# Altium schematic sheet UI_Ticketing_Master.SchDoc
size A4; Author: Mario Dos Santos; Organization: ETML-ES; Address1: Avenue Recordon 1; Address2: 1004 Lausanne; Address3: Switzerland; Revision: C; SheetNumber: 5; SheetTotal: 6
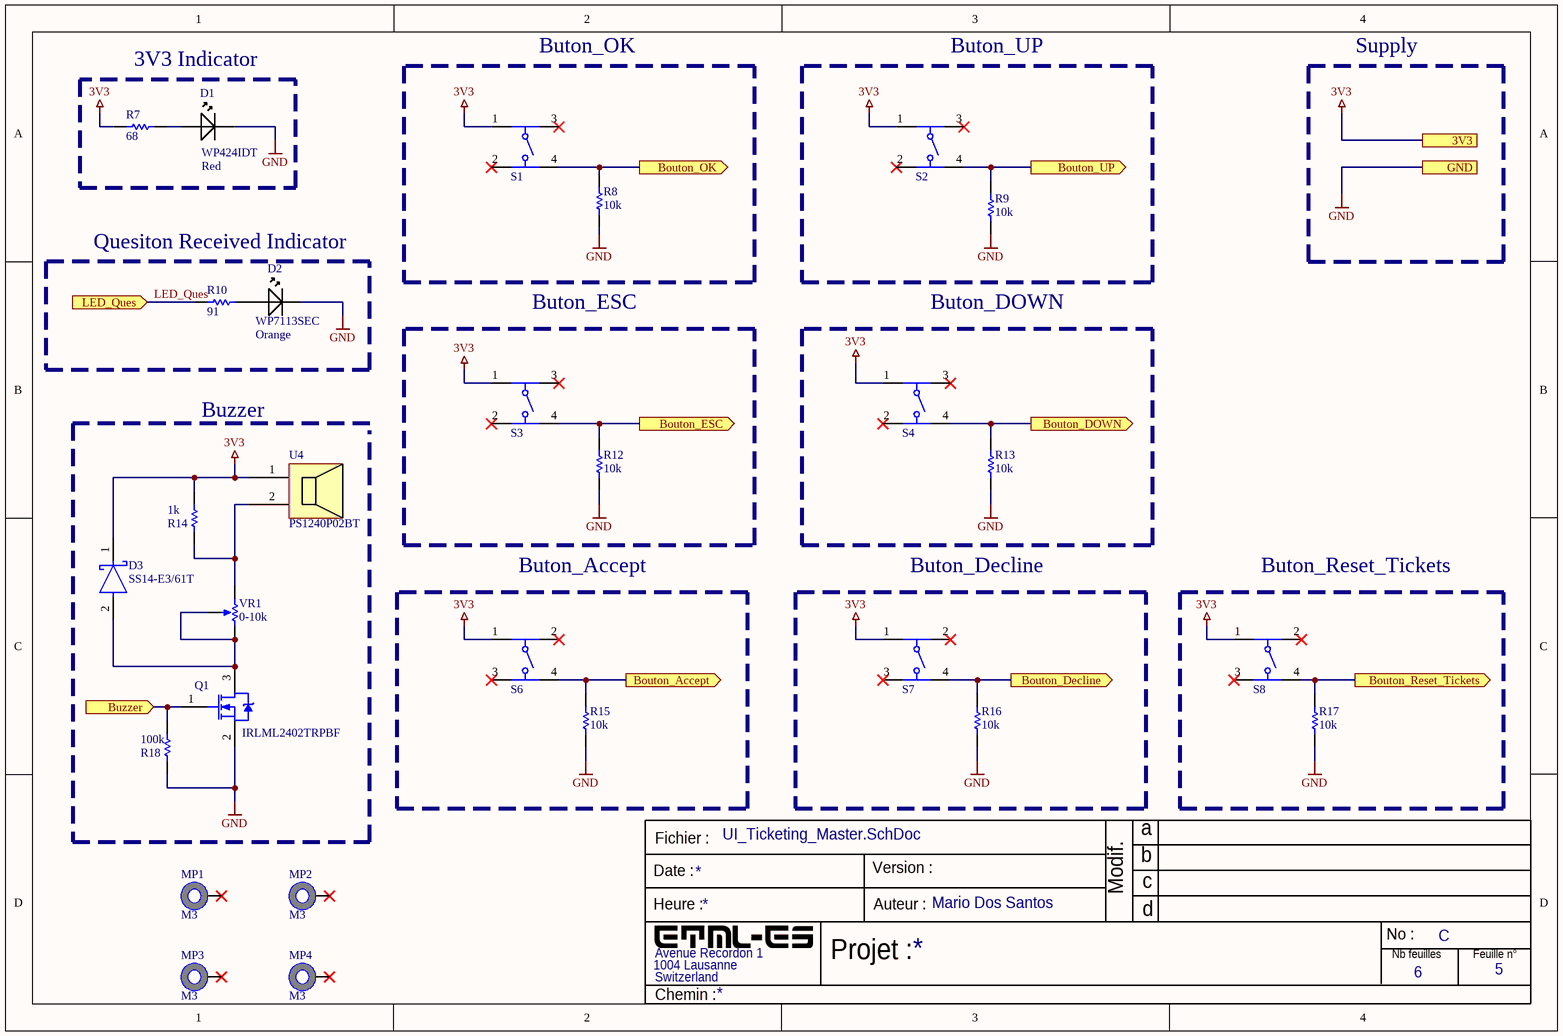
[diagram p0: UI_Ticketing_Master.SchDoc]

## Parts
D1  WP424IDT  Color: Red  [LED-2P-2.28-3MM]
D2  WP7113SEC  Color: Orange  [Type 5mm]
D3  SS14-E3/61T  [FP-95400-MFG]
MP1  M3  [9774010151]
MP2  M3  [9774010151]
MP3  M3  [9774010151]
MP4  M3  [9774010151]
Q1  IRLML2402TRPBF  [INTR-IRLML2402TRPBF-3_V]
R7  68  [RESC0805(2012)_L]
R8  10k  [RESC0805(2012)_L]
R9  10k  [RESC0805(2012)_L]
R10  91  [RESC0805(2012)_L]
R12  10k  [RESC0805(2012)_L]
R13  10k  [RESC0805(2012)_L]
R14  1k  [RESC2013X60X35ML10T20]
R15  10k  [RESC0805(2012)_L]
R16  10k  [RESC0805(2012)_L]
R17  10k  [RESC0805(2012)_L]
R18  100k  [RESC2013X60X35ML10T20]
S1  430152095826  [430152095826]  (value not drawn)
S2  430152095826  [430152095826]  (value not drawn)
S3  430152095826  [430152095826]  (value not drawn)
S4  430152095826  [430152095826]  (value not drawn)
S6  430466073726  [4304x60737x6_12x12x7.3]  (value not drawn)
S7  430466073726  [4304x60737x6_12x12x7.3]  (value not drawn)
S8  430466073726  [4304x60737x6_12x12x7.3]  (value not drawn)
U4  PS1240P02BT  [Buzzer]
VR1  0-10k  [BOUR-3362P]

## Blocks framed on the sheet
3V3 Indicator: D1 R7
Buton_OK: R8 S1
Buton_UP: R9 S2
Quesiton Received Indicator: D2 R10
Buton_ESC: R12 S3
Buton_DOWN: R13 S4
Buton_Accept: R15 S6
Buton_Decline: R16 S7
Buton_Reset_Tickets: R17 S8

## Ports
3V3, Bouton_Accept (out), Bouton_Decline (out), Bouton_DOWN (out), Bouton_ESC (out), Bouton_OK (out), Bouton_Reset_Tickets (out), Bouton_UP (out), Buzzer (in), GND, LED_Ques (in)

## Nets
3V3: D3.1(C) R7.2 R14.2 S1.1 S2.1 S3.1 S4.1 S6.1 S7.1 S8.1 U4.1 ; port 3V3
GND: D1.2(Cathode) D2.1(Cathode) Q1.2(S) R8.2 R9.2 R12.2 R13.2 R15.2 R16.2 R17.2 R18.1 ; port GND
Bouton_Accept: R15.1 S6.4 ; port Bouton_Accept
Bouton_Decline: R16.1 S7.4 ; port Bouton_Decline
Bouton_DOWN: R13.1 S4.4 ; port Bouton_DOWN
Bouton_ESC: R12.1 S3.4 ; port Bouton_ESC
Bouton_OK: R8.1 S1.4 ; port Bouton_OK
Bouton_Reset_Tickets: R17.1 S8.4 ; port Bouton_Reset_Tickets
Bouton_UP: R9.1 S2.4 ; port Bouton_UP
Buzzer: Q1.1(G) R18.2 ; port Buzzer
LED_Ques: R10.2 ; port LED_Ques
NetD1_1: D1.1(Anode) R7.1
NetD2_2: D2.2(Anode) R10.1
NetD3_2: D3.2(A) Q1.3(D) VR1.2(S) VR1.3(CW)
NetR14_1: R14.1 U4.2 VR1.1(CCW)

Not connected (* = marked no-connect by the designer): MP1 1*; MP2 1*; MP3 1*; MP4 1*; S1 2* 3*; S2 2* 3*; S3 2* 3*; S4 2* 3*; S6 2* 3*; S7 2* 3*; S8 2* 3*

## Notes on the sheet
- Supply
- Buzzer
- Fichier :
- a
- Date :
- Heure :
- Version :
- Auteur :
- Modif.
- b
- c
- d
- Projet :
- No :
- Nb feuilles
- Feuille n°
- Chemin :

## Library data of the parts
D1 D2 = LED: Supplier: Digi-Key; Supplier unit price: 0.4
  D1: Supplier Part Number: 754-1305-ND; Value: WP424IDT
  D2: Supplier A: *; Supplier B: *; Supplier A Ref: 754-1271-ND; Supplier B Ref: *; Manufacturer URL: *; Manufacturer Ref: *; Package: *; Value: WP7113SEC; Supplier Part Number: 754-1271-ND
D3 = CMP-02539-000035-1: DIODE SCHOTTKY 40V 1A DO214AC; Manufacturer: Vishay; Peak Reverse Current: 0.2mA; Standoff Height: 0mm; Max Junction Temp: +150°C; Max Surge Forward Current: 40A; RoHS: TRUE; Digikey Description: DIODE SCHOTTKY 40V 1A DO214AC; Category: Diode; Device Class L3: Schottky Diodes; Temperature Range High: +150°C; Automotive: No; Temperature: -65°C to +150°C; Device Class L2: Diodes; Forward Current: 1A; Temperature Range Low: -65°C; Footprint Url: http://www.vishay.com/docs/95400/sma.pdf; Octopart: https://octopart.com/ss14-e3%2F61t-vishay-39552847; Package: 95400; Max Repetitive Reverse Voltage: 40V; ComponentLink2Description: Datasheet; ComponentLink2URL: http://www.vishay.com/docs/88746/ss12.pdf; Lead Free: Yes; Height: 2.29mm; Mouser Description: SS14 Series 40 V 1 A Surface Mount Schottky Barrier Rectifier - DO-214AC (SMA); Manufacturer Part Number: SS14-E3/61T; Device Class L1: Discrete Semiconductors; Supplier: Digi-Key; Supplier Part Number: SS14-E3/61TGICT-ND; Supplier unit price: 0.48
MP1-MP4 = 9774010151: WA-SMSI SMT Steel Spacer, M2.5 Thread Internal, Length 1mm; Supplier: Digi-Key
Q1 = CMP-2000-05155-1: HEXFET(R) Power MOSFET, N-Channel, 20 V, 1.2 A, 3-Pin SOT-23, RoHS, Tape and Reel; Manufacturer: Infineon Technologies; PartNumber: IRLML2402TRBF; PackageCase: SOT-23; Supplier: Digi-key; Supplier PN: IRLML2402PBFCT-ND; Value: IRLML2402TRPBF; Supplier Part Number: IRLML2402PBFCT-ND; Supplier unit price: 0.41
R7 = CMP-1013-00122-1: 100K 0.125W 5% 0805 (2012 Metric)  SMD; Value: 68; Supplier: Digi-Key; Supplier Part Number: RMCF0805JT68R0CT-ND; Supplier unit price: 0.1
R8-R10 R12 R13 R15-R17 = CMP-1013-00122-1: 100K 0.125W 5% 0805 (2012 Metric)  SMD; Case-Metric: 2012; Case-EIA: 0805; Tolerance: 5 %; Technology: SMT; Power: 0.125 W; Supplier: Digi-Key; Supplier unit price: 0.1
  R8 R9 R12 R13 R15-R17: Value: 10k; Supplier Part Number: 311-10KLGCT-ND
  R10: Value: 91; Supplier Part Number: RMCF0805JT68R0C  T-ND
R14 = CMP-2100-03671-1: Chip Resistor, 1 KOhm, +/- 1%, 125 mW, -55 to 155 degC, 0805 (2012 Metric), RoHS, Tape and Reel; Voltage Rating: 150V; PackageCase: 0805; Value: 1k; Supplier: Digi-Key; Supplier Part Number: YAG3703CT-ND; Supplier unit price: 0.1
R18 = CMP-2100-03671-1: Chip Resistor, 100 KOhm, +/- 1%, 125 mW, -55 to 155 degC, 0805 (2012 Metric), RoHS, Tape and Reel; Voltage Rating: 150V; PackageCase: 0805; Value: 100k; Supplier: Digi-Key; Supplier Part Number: YAG3688CT-ND; Supplier unit price: 0.1
S1-S4 = 430152095826: 6x6mm SMD Tact Switch WS-TASV, height 9.5 mm, 260 gf; Part Number: 732-6999-1-ND; Rated Current: 50 mA; Operation Force: 260 gf; Rated Voltage: 12 VDC; ComponentLink1Description: Manufacturer; ComponentLink1URL: http://www.we-online.de; ComponentLink2Description: Datasheet; ComponentLink2URL: http://katalog.we-online.de/em/datasheet/4301x2xxx8x6.pdf; Published Date: Nov. 2017; Publisher: Wurth Elektronik; Life Cycle: 200000; Operating Temperature: -40 to +85 degC; Size: 6x6x9.5 mm; Value: 430152095826; Supplier: Digi-Key; Supplier Part Number: 732-6999-1-ND; Supplier unit price: 0.51
S6-S8 = 430466073726: WS-TATV 12x12mm washable Tact Switch, THT version; Part Number: 430466073726-ND; Operation Force: 260g; ComponentLink1Description: Manufacturer; ComponentLink1URL: http://www.we-online.de; ComponentLink2Description: Datasheet; ComponentLink2URL: http://katalog.we-online.de/em/datasheet/4304x60737x6.pdf; Published Date: June 2017; Publisher: Wurth Elektronik; Size: 12x12x7.3 mm; Life Cycle: 300000 cycles; Value: 430466073726; Supplier: Digi-Key; Supplier Part Number: 430466073726-ND; Supplier unit price: 0.56
U4 = BZR: Buzzer 12mm piezo; Manufacturer: TDK Corporation; Value: PS1240P02BT; Supplier: Digi-Key; Supplier Part Number: 445-2525-1-ND; Supplier unit price: 0.6
VR1 = CMP-1747-00003-1: Square Trimpot(R) Trimming Potentiometer, 100 KOhm, 300 V, -55 to 125 degC, 3-Pin THD, RoHS, Tube; Part Number: 3362P-103LF-ND; Voltage Rating: 250 V; Case\Package: Axial; Tolerance: 1%; Power Rating: 250 mW; Resistance: 10k; RoHSCompliant: true; ComponentLink2URL: http://www.bourns.com/docs/Product-Datasheets/3362.pdf; ComponentLink1Description: Manufacturer URL; DatasheetVersion: May-16; Package Quantity: 200; ComponentLink2Description: Datasheet; Min Operating Temperature: -55 degC; Mount: Through Hole; PackageDescription: 3-Pin Through Hole Device, Body 6.6 x 6.99 mm, Pitch 2.54 mm; Length: 0.248 inch; ComponentLink1URL: http://www.bourns.com/; PackageReference: 3326P; Max Operating Temperature: 155 degC; Packaging: Bulk; Value: 0-10k; Supplier: Digi-Key; Supplier Part Number: 3362P-103LF-ND; Supplier unit price: 0.99